# EAGLE design DualPower (EAGLE 9.6.2)
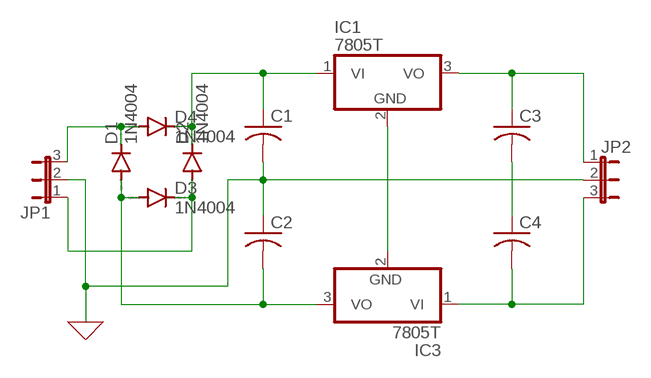
[diagram p0: schematic, sheet 1]

## Parts
C1  C-US025-024X044  [C025-024X044]
C2  C-US025-024X044  [C025-024X044]
C3  C-US025-024X044  [C025-024X044]
C4  C-US025-024X044  [C025-024X044]
D1  1N4004  [DO41-10]
D2  1N4004  [DO41-10]
D3  1N4004  [DO41-10]
D4  1N4004  [DO41-10]
IC1  7805T  [TO220H]
IC3  7805T  [TO220H]
JP1  JP2E  [JP2]
JP2  JP2E  [JP2]

## Nets
0: C1.2 C2.1 JP1.2 JP2.2 ; supply symbol labelled GND
N$1: D1.C D4.A JP1.3
N$2: C2.2 D1.A D3.A IC3.3(VO)
N$3: D2.A D3.C JP1.1
N$4: C1.1 D2.C D4.C IC1.1(VI)
N$7: IC1.2(GND) IC3.2(GND)
N$8: C3.1 IC1.3(VO) JP2.1
N$9: C3.2 C4.1
N$10: C4.2 IC3.1(VI) JP2.3

## Library data of the parts
C1-C4 = rcl:C-US: CAPACITOR, American symbol; SPICEPREFIX: C
D1-D4 = diode:1N4004: DIODE general purpose rectifier, 1 A
IC1 IC3 = linear:78*: Positive VOLTAGE REGULATOR Source: http://cache.national.com/ds/LM/LM78L05.pdf http://www.fairchildsemi.com/ds/LM/LM7805.pdf
JP1 JP2 = jumper:JP2E: JUMPER

## Board
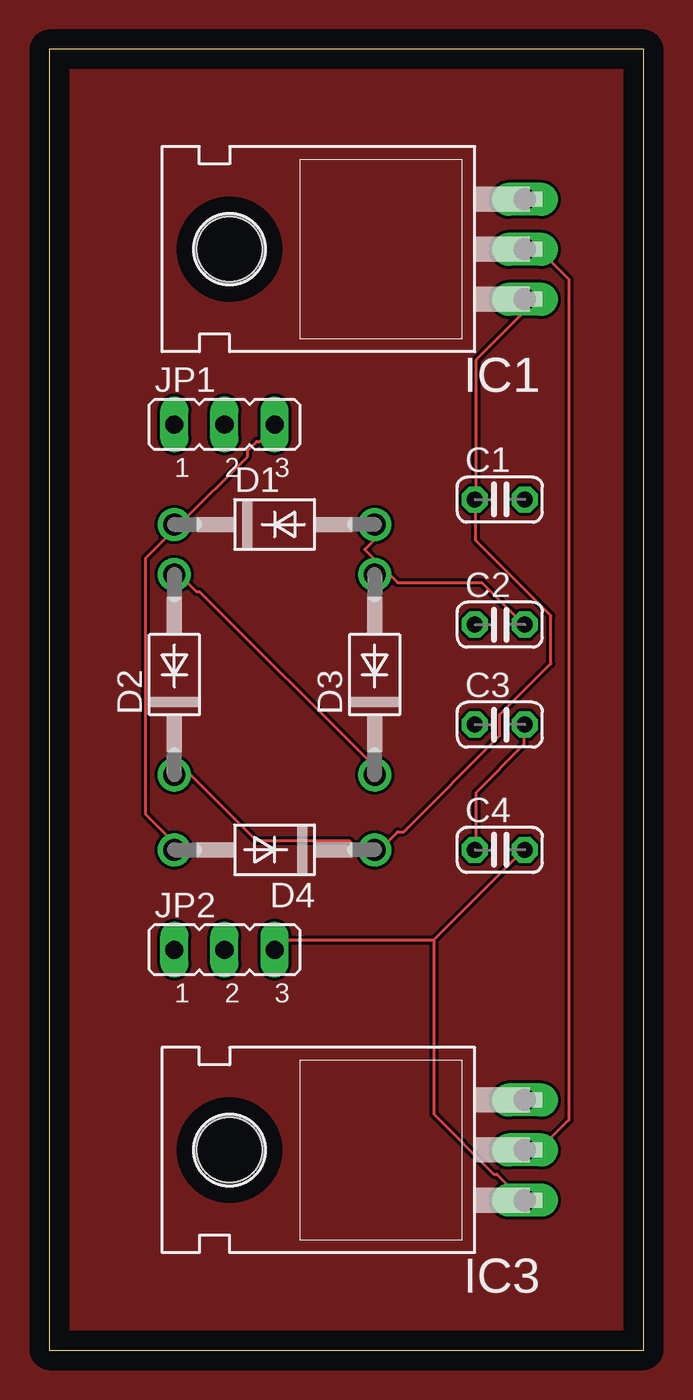
[diagram p1: board, top side]
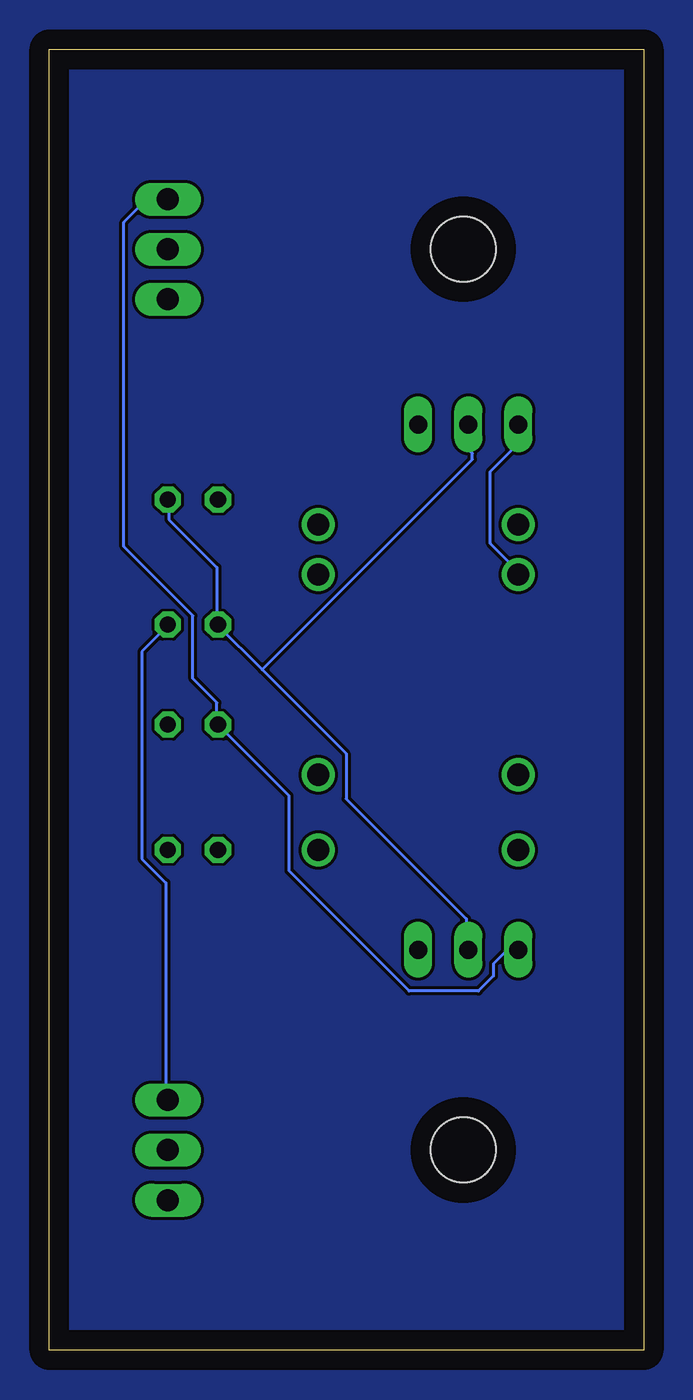
[diagram p2: board, bottom side, seen from below]

Size 30.15 x 66.03 mm. Coordinates in mm from the lower left corner, seen from the top.
Outline: 0,0 30.15,0 30.15,66.03 0,66.03 0,0
Copper layers (1*16): Top 0.035mm / dielectric 1.5mm / Bottom 0.035mm
Design rules "default": minimum track width 6mil, minimum drill 0.35mm, track to track 6mil, track to pad 6mil, pad to pad 6mil, via to via 6mil, smd to smd 6mil, copper to edge 40mil, drill to drill 6mil, minimum pad ring 10mil, minimum via ring 8mil, stop-mask expansion 4mil, vias tented up to drill 0mil, thermal gap 10mil

### Footprints (pad centres in the part's own frame; a part is rotated, then mirrored left to right if it is on the bottom)
C025-024X044 = drill 0.813 octagon: 1 -1.27,0; 2 1.27,0
DO41-10 = drill 1.118: A 5.08,0; C -5.08,0
TO220H = drill 1.118 long: 1 -2.54,-10.16; 2 0,-10.16; 3 2.54,-10.16 | hole 3.302: 0,4.826
JP2 = drill 0.914 long: 1 -2.54,0; 2 0,0; 3 2.54,0

### Placement (x,y rotation side)
C1  22.86,43.18 0 top
C2  22.86,36.83 0 top
C3  22.86,31.75 0 top
C4  22.86,25.4 0 top
D1  11.43,41.91 0 top
D2  6.35,34.29 90 top
D3  16.51,34.29 90 top
D4  11.43,25.4 180 top
IC1  13.97,55.88 90 top
IC3  13.97,10.16 90 top
JP1  8.89,46.99 0 top
JP2  8.89,20.32 0 top

### Tracks (layer width: path | path; a pad name or v marks a point on that pad's centre or on a via)
0
  Bottom 0.152: 21.64,36.83 21.64,39.73 24.08,42.16 24.08,43.08 C1.2 | 21.64,36.83 19.36,34.54 | 19.36,34.54 15.09,30.28 15.09,27.99 8.99,21.89 8.99,20.37 JP2.2 | 21.64,36.83 C2.1 | 19.36,34.54 8.69,45.21 8.69,45.52 8.84,45.67 8.84,46.89 JP1.2
GND
  pour Top: -2.54,67.31 -2.54,-3.81 34.29,-3.81 34.29,68.58 31.75,68.58 -2.54,68.58
  pour Bottom: -5.08,68.58 -5.08,-6.35 36.83,-6.35 36.83,71.12 -5.08,71.12
N$1
  Top 0.152: JP1.3 11.43,46.89 10.67,46.13 10.52,46.13 10.06,45.67 10.06,45.36 6.71,42.01 6.4,42.01 D1.C 6.25,41.86 6.25,41.55 4.88,40.18 4.88,27.23 6.25,25.86 6.25,25.4 D4.A
N$2
  Top 0.152: C2.2 24.08,36.83 21.95,38.96 17.68,38.96 17.37,39.27 16.61,39.27 D3.A 16.46,39.42 16.46,40.18 16,40.64 16.46,41.1 16.46,41.86 D1.A
  Bottom 0.152: IC3.3 24.23,12.75 24.23,23.72 25.45,24.94 25.45,35.46 24.08,36.83 C2.2
N$3
  Top 0.152: D3.C 16.46,29.21 16.46,29.67 7.62,38.51 7.47,38.51 6.71,39.27 6.4,39.27 D2.A
  Bottom 0.152: JP1.1 6.4,46.89 6.4,45.97 7.77,44.6 7.77,40.94 6.25,39.42 D2.A
N$4
  Top 0.152: IC1.1 24.08,53.29 24.08,52.68 21.64,50.24 21.64,43.23 C1.1 21.64,43.08 21.64,41.1 25.45,37.29 25.45,34.85 22.86,32.26 22.86,31.19 17.98,26.31 17.68,26.31 16.76,25.4 D4.C 15.7,25.4 15.24,25.86 10.52,25.86 7.16,29.21 D2.C
N$7
  Top 0.152: IC3.2 24.84,10.16 26.36,11.68 26.36,54.36 24.84,55.88 IC1.2
N$8
  Bottom 0.152: JP2.1 6.4,20.22 7.01,20.22 7.62,19.61 7.62,19 8.38,18.24 11.89,18.24 17.98,24.33 17.98,28.14 C3.1 21.64,31.8 21.64,32.87 22.86,34.09 22.86,37.29 26.36,40.79 26.36,57.25 25.3,58.32 24.23,58.32 IC1.3
N$9
  Top 0.152: C4.1 21.64,25.4 21.64,28.3 24.08,30.73 24.08,31.65 C3.2
N$10
  Top 0.152: 19.51,20.83 24.08,25.4 C4.2 | 19.51,20.83 11.89,20.83 11.43,20.37 JP2.3 | 19.51,20.83 19.51,11.99 22.55,8.94 22.71,8.94 23.32,8.33 23.47,8.33 24.08,7.72 IC3.1